# Altium project dcbuddy_split_v2.PrjPcb
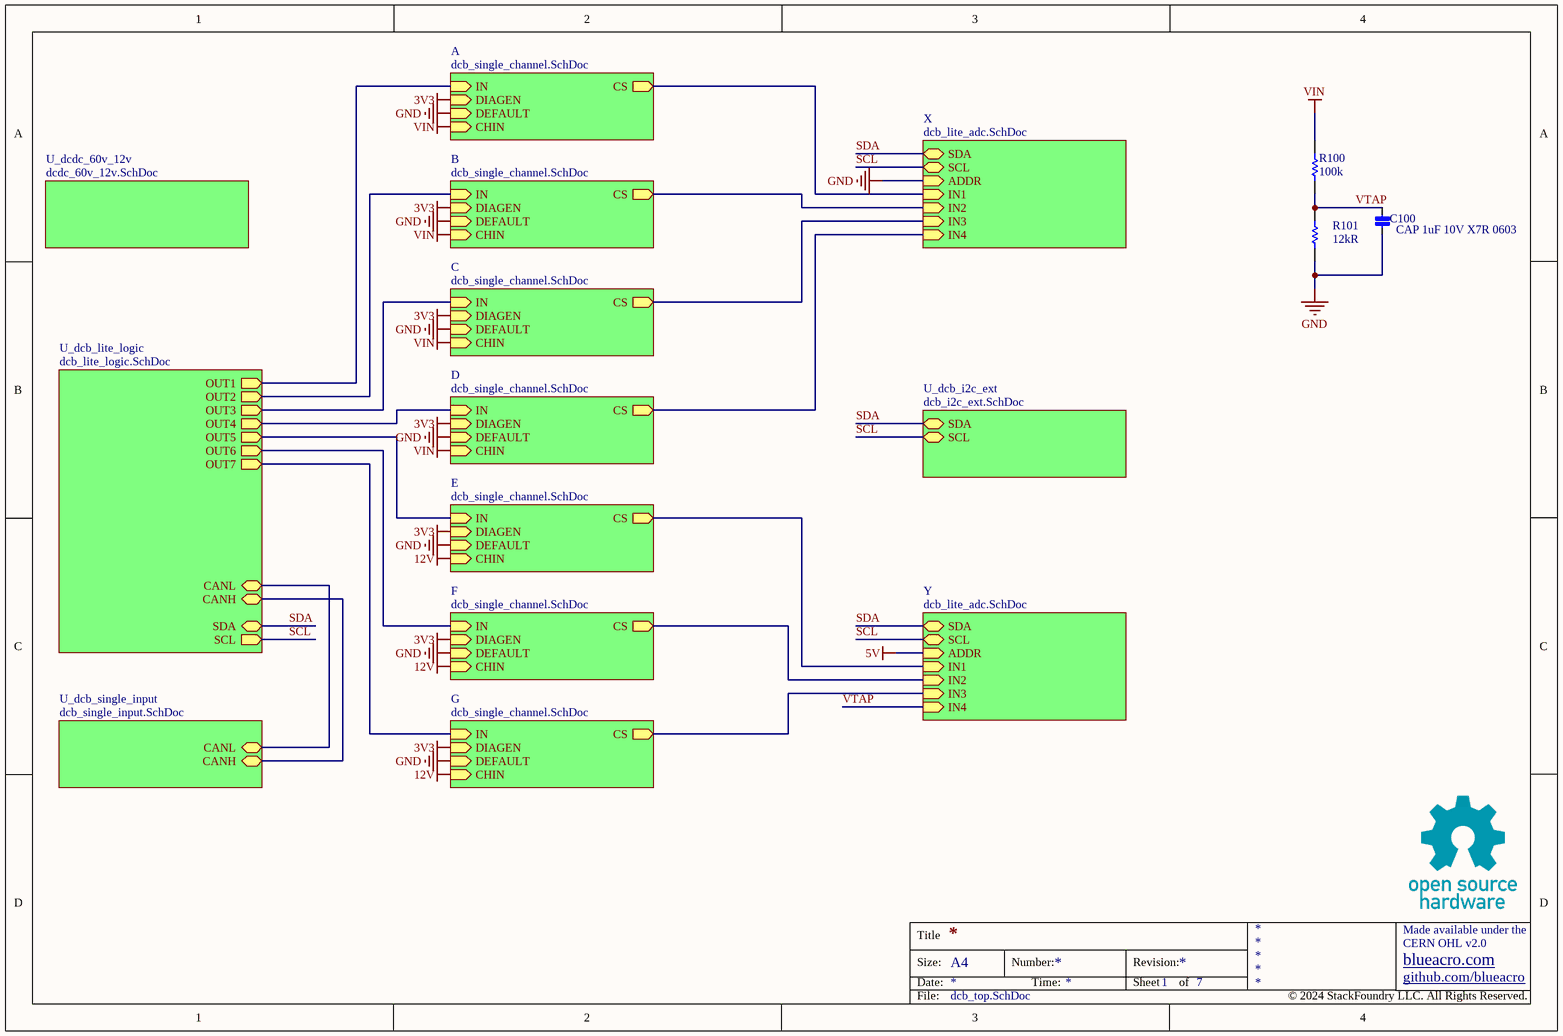
[diagram p0: dcb_top.SchDoc]
7 sheets, 174 parts. Net scope: hierarchical (ports join the sheet entries above them; power ports are global).
Board file: dcb_split_v2.PcbDoc
Sheets:
  dcb_top.SchDoc
    A = dcb_single_channel.SchDoc
    B = dcb_single_channel.SchDoc
    C = dcb_single_channel.SchDoc
    D = dcb_single_channel.SchDoc
    E = dcb_single_channel.SchDoc
    F = dcb_single_channel.SchDoc
    G = dcb_single_channel.SchDoc
    U_dcb_lite_logic = dcb_lite_logic.SchDoc
      U_usb_input = usb_input.SchDoc
    X = dcb_lite_adc.SchDoc
    Y = dcb_lite_adc.SchDoc
    U_dcb_single_input = dcb_single_input.SchDoc
    U_dcdc_60v_12v = dcdc_60v_12v.SchDoc

## Sheet dcb_top.SchDoc
size A4; SheetNumber: 1; SheetTotal: 7

### Parts
C100  CAP 1uF 10V X7R 0603  [FP-CL10-IPC_B]
R100  value 100k  [RESC1608-IPC-LL]  (hidden comment: 100k 0603 1%)
R101  value 12kR  [RESC1608X55X25LL10T15]  (hidden comment: 12k 0603 1%)

### Sub-sheets
A = dcb_single_channel.SchDoc: IN (in), DIAGEN (in), CS (out), DEFAULT (in), CHIN (in)
B = dcb_single_channel.SchDoc: IN (in), DIAGEN (in), CS (out), DEFAULT (in), CHIN (in)
C = dcb_single_channel.SchDoc: IN (in), DIAGEN (in), CS (out), DEFAULT (in), CHIN (in)
D = dcb_single_channel.SchDoc: IN (in), DIAGEN (in), CS (out), DEFAULT (in), CHIN (in)
E = dcb_single_channel.SchDoc: IN (in), DIAGEN (in), CS (out), DEFAULT (in), CHIN (in)
F = dcb_single_channel.SchDoc: IN (in), DIAGEN (in), CS (out), DEFAULT (in), CHIN (in)
G = dcb_single_channel.SchDoc: IN (in), DIAGEN (in), CS (out), DEFAULT (in), CHIN (in)
U_dcb_i2c_ext = dcb_i2c_ext.SchDoc (file not in this document): SDA (bidir), SCL (bidir)
U_dcb_lite_logic = dcb_lite_logic.SchDoc: OUT1 (out), OUT2 (out), OUT3 (out), OUT4 (out), OUT5 (out), OUT6 (out), OUT7 (out), SDA (bidir), SCL (out), CANL (bidir), CANH (bidir)
U_dcb_single_input = dcb_single_input.SchDoc: CANH (bidir), CANL (bidir)
U_dcdc_60v_12v = dcdc_60v_12v.SchDoc: no entries
X = dcb_lite_adc.SchDoc: SDA (bidir), SCL (bidir), ADDR (in), IN1 (in), IN2 (in), IN3 (in), IN4 (in)
Y = dcb_lite_adc.SchDoc: SDA (bidir), SCL (bidir), ADDR (in), IN1 (in), IN2 (in), IN3 (in), IN4 (in)

### Nets
3V3: sheet A/DIAGEN, sheet B/DIAGEN, sheet C/DIAGEN, sheet D/DIAGEN, sheet E/DIAGEN, sheet F/DIAGEN, sheet G/DIAGEN
12V: sheet E/CHIN, sheet F/CHIN, sheet G/CHIN
GND: C100.2 R101.1 ; sheet A/DEFAULT, sheet B/DEFAULT, sheet C/DEFAULT, sheet D/DEFAULT, sheet E/DEFAULT, sheet F/DEFAULT, sheet G/DEFAULT, sheet X/ADDR
VIN: R100.2 ; sheet A/CHIN, sheet B/CHIN, sheet C/CHIN, sheet D/CHIN
CANH: sheet U_dcb_lite_logic/CANH, sheet U_dcb_single_input/CANH
CANL: sheet U_dcb_lite_logic/CANL, sheet U_dcb_single_input/CANL
SCL: sheet U_dcb_lite_logic/SCL, sheet X/SCL, sheet Y/SCL, sheet U_dcb_i2c_ext/SCL
SDA: sheet U_dcb_lite_logic/SDA, sheet X/SDA, sheet Y/SDA, sheet U_dcb_i2c_ext/SDA
VTAP: C100.1 R100.1 R101.2 ; sheet Y/IN4
NetC202_A_1: sheet A/CS, sheet X/IN1
NetC202_B_1: sheet B/CS, sheet X/IN2
NetC202_C_1: sheet C/CS, sheet X/IN3
NetC202_D_1: sheet D/CS, sheet X/IN4
NetC202_E_1: sheet E/CS, sheet Y/IN1
NetC202_F_1: sheet F/CS, sheet Y/IN2
NetC202_G_1: sheet G/CS, sheet Y/IN3
NetQ200_A_1: sheet A/IN, sheet U_dcb_lite_logic/OUT1
NetQ200_B_1: sheet B/IN, sheet U_dcb_lite_logic/OUT2
NetQ200_C_1: sheet C/IN, sheet U_dcb_lite_logic/OUT3
NetQ200_D_1: sheet D/IN, sheet U_dcb_lite_logic/OUT4
NetQ200_E_1: sheet E/IN, sheet U_dcb_lite_logic/OUT5
NetQ200_F_1: sheet F/IN, sheet U_dcb_lite_logic/OUT6
NetQ200_G_1: sheet G/IN, sheet U_dcb_lite_logic/OUT7

### Notes on the sheet
- Title
- Size:
- Date:
- A4
- Number:
- Time:
- Revision:
- Sheet
- of
- github.com/blueacro
- blueacro.com
- CERN OHL v2.0
- Made available under the
- File:
- © 2024 StackFoundry LLC. All Rights Reserved.

### Library data of the parts
C100 = CMP-001-00085-7: Cap Ceramic 1uF 10V X7R 10% SMD 0603 125C Paper T/R
R100 = CMP-009-00222-1: SMD Chip Resistor, 100 kOhm, ± 1%, 100 mW, 0603 [1608 Metric], Thick Film, General Purpose; Voltage Rating: 50V; Case Code (Metric): 1608; Height: 0.45mm; Tolerance: 1%; Width: 0.8mm; Resistance Tolerance: 1%; Case/Package: 0603; Case Code (Imperial): 0603
R101 = CMP-009-00236-1: SMD Chip Resistor, 12 kOhm, ± 1%, 100 mW, 0603 [1608 Metric], Thick Film, General Purpose; Voltage Rating: 50V; Temperature Coefficient: 100ppm/°C; Power Rating: 100mW; Number of Terminations: 2; Features: Moisture Resistant; Termination: SMD/SMT; Case Code (Imperial): 0603; Pins: 2; Case Code (Metric): 1608; Depth: 0.8mm; Reach SVHC Compliant: No; Packaging: Tape and Reel; Width: 0.8mm; Resistance Tolerance: 1%; Resistor Type: Thick Film; Min Operating Temperature: -55°C; Series: RC; RoHS Compliant: Yes; Case/Package: 0603; Length: 1.6mm; Voltage Rating (DC): 50V; Lead Free: Lead Free; Max Operating Temperature: 155°C; Max Power Dissipation: 100mW; Construction: Rectangular; Tolerance: 1%; Military Standard: Not

## Sheet dcb_single_channel.SchDoc
size A4; SheetNumber: 6; SheetTotal: 8
Used 7 times, as channels A, B, C, D, E, F, G. Parts and nets are listed once, with the designators drawn on the sheet.
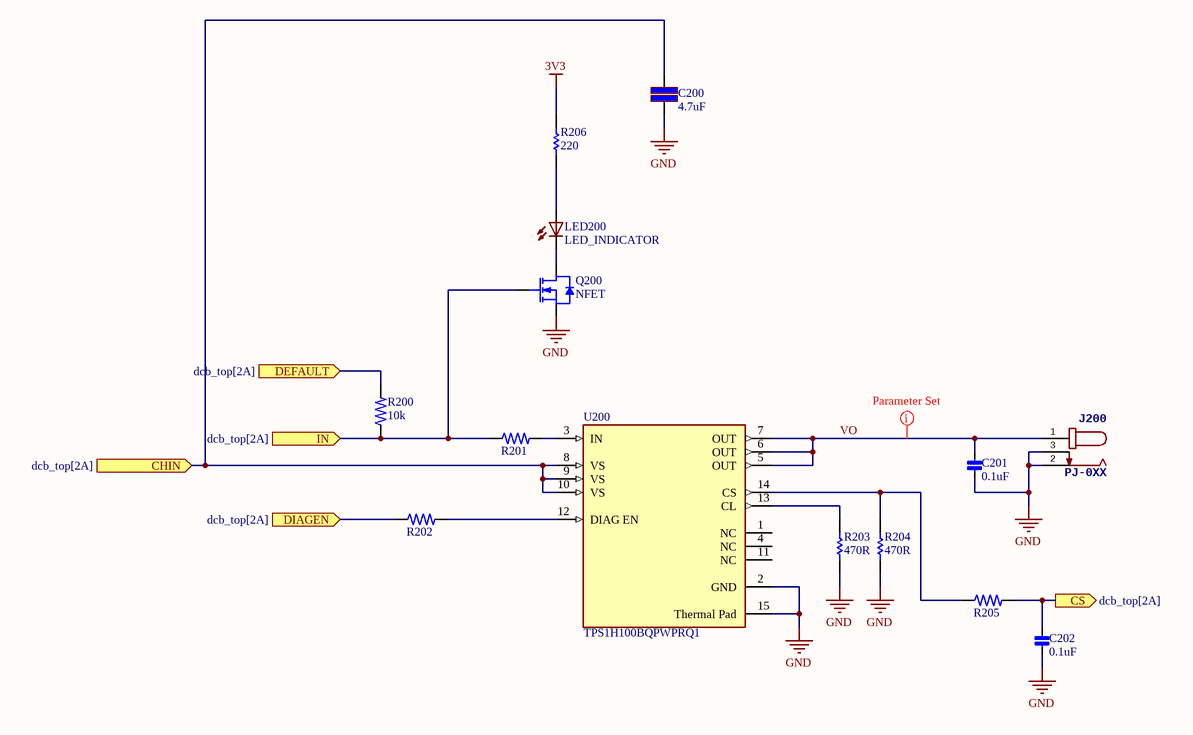
[diagram p1: dcb_single_channel.SchDoc]

### Parts
C200  value 4.7uF  [CAPC3225X20N]  (hidden comment: CAP 4.7uF 50V X7R 1210)
C201  value 0.1uF  [FP-CL10-IPC_B]  (hidden comment: CAP 0.1uF 50V X7R 0603)
C202  value 0.1uF  [FP-CL10-IPC_B]  (hidden comment: CAP 0.1uF 50V X7R 0603)
J200  PJ-0XX  [CUI-PJ-002A_V]
LED200  LED_INDICATOR  [LED5MM]
Q200  NFET  [SOT23-3]
R200  value 10k  [RESC1608-IPC-ML]  (hidden comment: 10K 0603 1%)
R201  4.7k 0603 1%  [RESC1608-IPC-ML]  (value not drawn)
R202  4.7k 0603 1%  [RESC1608-IPC-ML]  (value not drawn)
R203  value 470R  [RESC2013X60X35LL10T20]  (hidden comment: RC0805FR-07470RL)
R204  value 470R  [RESC2013X60X35LL10T20]  (hidden comment: RC0805FR-07470RL)
R205  4.7k 0603 1%  [RESC1608-IPC-ML]  (value not drawn)
R206  value 220  [RESC1608-IPC-ML]  (hidden comment: 220R 0603 5%)
U200  TPS1H100BQPWPRQ1  [FP-PWP0014C-IPC_C]

### Ports
CHIN (in, see dcb_top[2A]), CS (out, see dcb_top[2A]), DEFAULT (in, see dcb_top[2A]), DIAGEN (in, see dcb_top[2A]), IN (in, see dcb_top[2A])

### Nets
3V3: R206.2
GND: C200.1 C201.2 C202.2 J200.2 J200.3 Q200.2(S) R203.1 R204.1 U200.2(GND) U200.15(Thermal_Pad)
CHIN: C200.2 U200.8(VS) U200.9(VS) U200.10(VS) ; port CHIN
CS: C202.1 R205.2 ; port CS
DEFAULT: R200.2 ; port DEFAULT
DIAGEN: R202.1 ; port DIAGEN
IN: Q200.1(G) R200.1 R201.1 ; port IN
VO: C201.1 J200.1 U200.5(OUT) U200.6(OUT) U200.7(OUT)
NetLED200_A: LED200.A R206.1
NetLED200_C: LED200.C Q200.3(D)
NetR201_2: R201.2 U200.3(IN)
NetR202_2: R202.2 U200.12(DIAG_EN)
NetR203_2: R203.2 U200.13(CL)
NetR204_2: R204.2 R205.1 U200.14(CS)

Not connected (* = marked no-connect by the designer): U200 1(NC) 4(NC) 11(NC)

### Channels
A: designators end in _A; ports CHIN=VIN CS=NetC202_A_1 DEFAULT=GND DIAGEN=3V3 IN=NetQ200_A_1
B: designators end in _B; ports CHIN=VIN CS=NetC202_B_1 DEFAULT=GND DIAGEN=3V3 IN=NetQ200_B_1
C: designators end in _C; ports CHIN=VIN CS=NetC202_C_1 DEFAULT=GND DIAGEN=3V3 IN=NetQ200_C_1
D: designators end in _D; ports CHIN=VIN CS=NetC202_D_1 DEFAULT=GND DIAGEN=3V3 IN=NetQ200_D_1
E: designators end in _E; ports CHIN=12V CS=NetC202_E_1 DEFAULT=GND DIAGEN=3V3 IN=NetQ200_E_1
F: designators end in _F; ports CHIN=12V CS=NetC202_F_1 DEFAULT=GND DIAGEN=3V3 IN=NetQ200_F_1
G: designators end in _G; ports CHIN=12V CS=NetC202_G_1 DEFAULT=GND DIAGEN=3V3 IN=NetQ200_G_1

### Layout directives
net class HV: VO_A

### Notes on the sheet
- Title
- Size:
- Date:
- A4
- Number:
- Time:
- Revision:
- Sheet
- of
- github.com/blueacro
- blueacro.com
- CERN OHL v2.0
- Made available under the
- File:
- © 2024 StackFoundry LLC. All Rights Reserved.

### Library data of the parts
C200 = CMP-001-00083-3: CAP CER 4.7UF 50V X7R 1210; Tolerance: 10%; Material: Ceramic; Voltage: 50V; Capacitance: 4.7uF; Width: 0.098inch; Height: 1.8mm; Depth: 2.5mm; Package Quantity: 1; Case/Package: 1210; Case Code (Imperial): 1210; Contact Plating: Tin; Thickness: 0.079inch; Radiation Hardening: No; Voltage Rating: 50V; Packaging: Tape and Reel; Lead Free: Lead Free; Dielectric: X7R; Min Operating Temperature: -55°C; Case Code (Metric): 3225; Max Operating Temperature: 125°C; Mount: Surface Mount; Length: 3.2mm
C201 C202 = CMP-001-00084-7: Cap Ceramic 0.1uF 50V X7R 20% SMD 0603 125C Paper T/R; Voltage: 50V
J200 = CMP-167-0003-2: 2.0 x 6.5 mm, 2.5 A, Horizontal, Through Hole, Dc Power Jack Connector; Design Item ID: PJ-0XX; Source: con-jack.SCHLIB
LED200 = CMP-130-0003-6: Source: led.SchLib; Design Item ID: LED_INDICATOR
Q200 = CMP-094-0000-1: Design Item ID: NFET; Source: fet.SchLib
R200 = CMP-009-00191-4: Res General Purpose Thick Film 0603 10K Ohm 1% 1/10W ±100ppm/°C Molded SMD Paper T/R
R201 R202 R205 = CMP-009-00205-1: RES SMD 4.7K OHM 1% 1/10W 0603
R203 R204 = CMP-009-00233-1: SMD Chip Resistor, 470 Ohm, ± 1%, 125 mW, 0805 [2012 Metric], Thick Film, General Purpose; Voltage Rating (AC): 150V; Temperature Coefficient: 100ppm/°C; Power Rating: 125mW; Min Operating Temperature: -55°C; Series: RC; Construction: Rectangular; Resistance Tolerance: 1%; Height: 0.5mm; Resistor Type: Thick Film; Pins: 2; Case Code (Imperial): 0805; Depth: 1.25mm; Reach SVHC Compliant: Unknown; Case Code (Metric): 2012; Tolerance: 1%; Max Operating Temperature: 155°C; Termination: SMD/SMT; Length: 2mm; Lead Pitch: 0.4mm; RoHS Compliant: Yes; Case/Package: 0805; Voltage Rating: 150V; Number of Terminations: 2; Features: Moisture Resistant; Packaging: Tape and Reel; Voltage Rating (DC): 150V; Width: 1.25mm; Lead Free: Lead Free; Package Quantity: 5000; Max Power Dissipation: 125mW
R206 = CMP-009-00183-3: YAGEO - RC0603JR-07220RL - SMD Chip Resistor, 0603 [1608 Metric], 220 ohm, RC Series, 75 V, Thick Film, 100 mW; Power Rating: 100mW; Working Voltage: 75V; Temperature Coefficient: 100ppm/°C; Voltage Rating (DC): 50V; Military Standard: Not; Resistance: 220R; Case Code (Metric): 1608; Max Operating Temperature: 155°C; Tolerance: 5%; Case/Package: 0603; REACH SVHC: No SVHC; Case Code (Imperial): 0603; Number of Terminations: 2; Termination: SMD/SMT; Min Operating Temperature: -55°C; Packaging: Tape and Reel; Resistor Type: Thick Film; Number of Pins: 2; Depth: 0.8mm; Voltage Rating: 50V; Width: 0.8mm; Lead Free: Lead Free; Length: 1.6mm
U200 = CMP-024-00009-1: Current Limit SW 1-IN 1-OUT 5V to 40V 4A Automotive 14-Pin HTSSOP EP T/R; Number of Channels: 1; Min Supply Voltage: 3.5V; Output Configuration: High Side; Interface: On/Off; Fault Protection: Over Temperature; Packaging: Cut Tape; Max Supply Voltage: 40V; Lead Free: Lead Free; Max Operating Temperature: 125°C; Number of Outputs: 1; Height: 1.2mm; Length: 5mm; Pins: 14; Thickness: 1mm; RoHS Compliant: Yes; Min Operating Temperature: -40°C; Case/Package: HTSSOP; Width: 4.4mm; Series: Automotive, AEC-Q100; Max Output current: 4A

## Sheet dcb_lite_logic.SchDoc
size A4; SheetNumber: 4; SheetTotal: 8
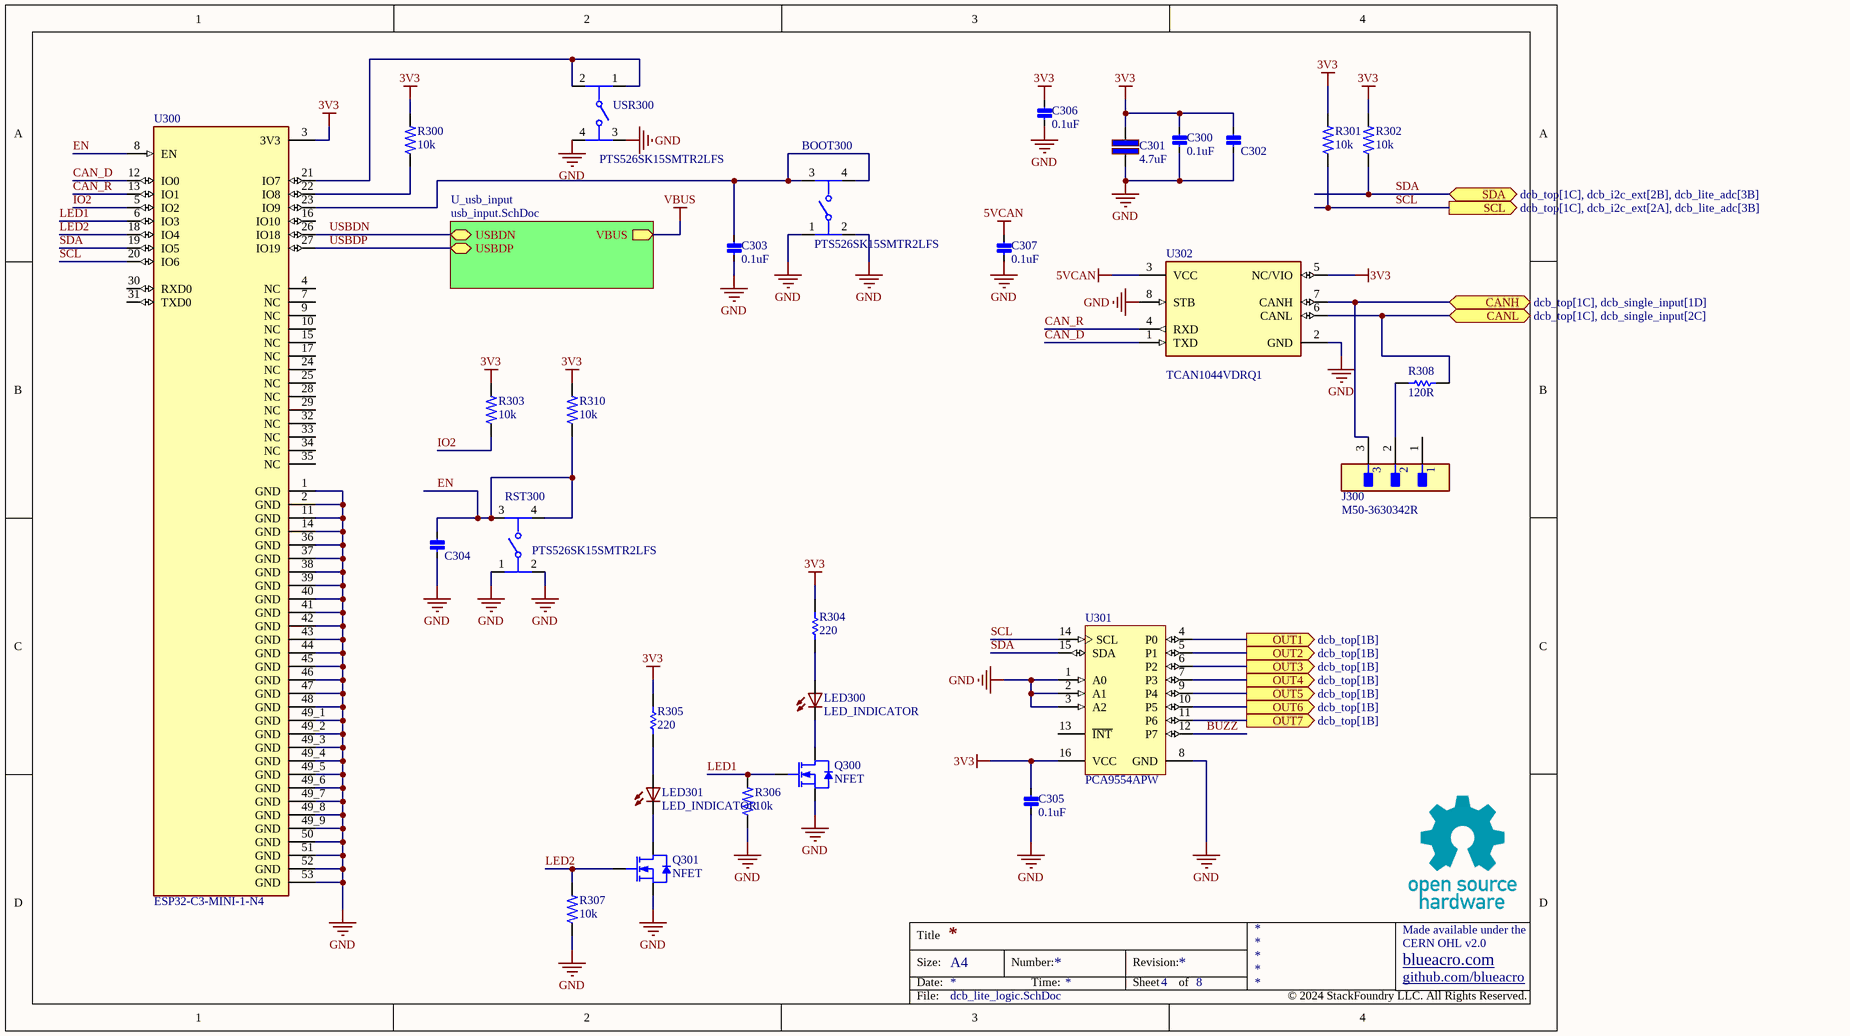
[diagram p2: dcb_lite_logic.SchDoc]

### Parts
BOOT300  PTS526SK15SMTR2LFS  [FP-PTS526SK15SMTR2LFS-MFG]
C300  value 0.1uF  [FP-CL10-IPC_B]  (hidden comment: CAP 0.1uF 50V X7R 0603)
C301  value 4.7uF  [CAPC3225X20N]  (hidden comment: CAP 4.7uF 50V X7R 1210)
C302  CAP 1uF 10V X7R 0603  [FP-CL10-IPC_B]  (value not drawn)
C303  value 0.1uF  [FP-CL10-IPC_B]  (hidden comment: CAP 0.1uF 50V X7R 0603)
C304  CAP 1uF 10V X7R 0603  [FP-CL10-IPC_B]  (value not drawn)
C305  value 0.1uF  [FP-CL10-IPC_B]  (hidden comment: CAP 0.1uF 50V X7R 0603)
C306  value 0.1uF  [FP-CL10-IPC_B]  (hidden comment: CAP 0.1uF 50V X7R 0603)
C307  value 0.1uF  [FP-CL10-IPC_B]  (hidden comment: CAP 0.1uF 50V X7R 0603)
J300  M50-3630342R  [FP-M50-3630342R-MFG]
LED300  LED_INDICATOR  [LED5MM]
LED301  LED_INDICATOR  [LED5MM]
Q300  NFET  [SOT23-3]
Q301  NFET  [SOT23-3]
R300  value 10k  [RESC1608-IPC-ML]  (hidden comment: 10K 0603 1%)
R301  value 10k  [RESC1608-IPC-ML]  (hidden comment: 10K 0603 1%)
R302  value 10k  [RESC1608-IPC-ML]  (hidden comment: 10K 0603 1%)
R303  value 10k  [RESC1608-IPC-ML]  (hidden comment: 10K 0603 1%)
R304  value 220  [RESC1608-IPC-ML]  (hidden comment: 220R 0603 5%)
R305  value 220  [RESC1608-IPC-ML]  (hidden comment: 220R 0603 5%)
R306  value 10k  [RESC1608-IPC-ML]  (hidden comment: 10K 0603 1%)
R307  value 10k  [RESC1608-IPC-ML]  (hidden comment: 10K 0603 1%)
R308  value 120R  [RESC3225X70X50LL20T20]  (hidden comment: 120R 1210 5%)
R310  value 10k  [RESC1608-IPC-ML]  (hidden comment: 10K 0603 1%)
RST300  PTS526SK15SMTR2LFS  [FP-PTS526SK15SMTR2LFS-MFG]
U300  ESP32-C3-MINI-1-N4  [XCVR_ESP32-C3-MINI-1-N4]
U301  PCA9554APW  [PW0016A_L]
U302  TCAN1044VDRQ1  [FP-D0008A-IPC_B]
USR300  PTS526SK15SMTR2LFS  [FP-PTS526SK15SMTR2LFS-MFG]

### Sub-sheets
U_usb_input = usb_input.SchDoc: USBDN (bidir), USBDP (bidir), VBUS (out)

### Ports
CANH (bidir, see dcb_top[1C], dcb_single_input[1D]), CANL (bidir, see dcb_top[1C], dcb_single_input[2C]), OUT1 (out, see dcb_top[1B]), OUT2 (out, see dcb_top[1B]), OUT3 (out, see dcb_top[1B]), OUT4 (out, see dcb_top[1B]), OUT5 (out, see dcb_top[1B]), OUT6 (out, see dcb_top[1B]), OUT7 (out, see dcb_top[1B]), SCL (out, see dcb_top[1C], dcb_i2c_ext[2A], dcb_lite_adc[3B]), SDA (bidir, see dcb_top[1C], dcb_i2c_ext[2B], dcb_lite_adc[3B])

### Nets
3V3: C300.1 C301.2 C302.1 C305.1 C306.1 R300.2 R301.2 R302.2 R303.2 R304.2 R305.2 R310.2 U300.3(3V3) U301.16(VCC) U302.5(NC/VIO)
5VCAN: C307.1 U302.3(VCC)
GND: BOOT300.1 BOOT300.2 C300.2 C301.1 C302.2 C303.2 C304.2 C305.2 C306.2 C307.2 Q300.2(S) Q301.2(S) R306.1 R307.1 RST300.1 RST300.2 U300.1(GND) U300.2(GND) U300.11(GND) U300.14(GND) U300.36(GND) U300.37(GND) U300.38(GND) U300.39(GND) U300.40(GND) U300.41(GND) U300.42(GND) U300.43(GND) U300.44(GND) U300.45(GND) U300.46(GND) U300.47(GND) U300.48(GND) U300.49_1(GND) U300.49_2(GND) U300.49_3(GND) U300.49_4(GND) U300.49_5(GND) U300.49_6(GND) U300.49_7(GND) U300.49_8(GND) U300.49_9(GND) U300.50(GND) U300.51(GND) U300.52(GND) U300.53(GND) U301.1(A0) U301.2(A1) U301.3(A2) U301.8(GND) U302.2(GND) U302.8(STB) USR300.3 USR300.4
BUZZ: U301.12(P7)
CAN_D: U300.12(IO0) U302.1(TXD)
CAN_R: U300.13(IO1) U302.4(RXD)
CANH: J300.3 U302.7(CANH) ; port CANH
CANL: R308.2 U302.6(CANL) ; port CANL
EN: C304.1 R310.1 RST300.3 RST300.4 U300.8(EN)
IO2: R303.1 U300.5(IO2)
LED1: Q300.1(G) R306.2 U300.6(IO3)
LED2: Q301.1(G) R307.2 U300.18(IO4)
SCL: R301.1 U300.20(IO6) U301.14(SCL) ; port SCL
SDA: R302.1 U300.19(IO5) U301.15(SDA) ; port SDA
USBDN: U300.26(IO18) ; sheet U_usb_input/USBDN
USBDP: U300.27(IO19) ; sheet U_usb_input/USBDP
NetBOOT300_3: BOOT300.3 BOOT300.4 C303.1 U300.23(IO9)
NetJ300_2: J300.2 R308.1
NetLED300_A: LED300.A R304.1
NetLED300_C: LED300.C Q300.3(D)
NetLED301_A: LED301.A R305.1
NetLED301_C: LED301.C Q301.3(D)
NetQ200_A_1: U301.4(P0) ; port OUT1
NetQ200_B_1: U301.5(P1) ; port OUT2
NetQ200_C_1: U301.6(P2) ; port OUT3
NetQ200_D_1: U301.7(P3) ; port OUT4
NetQ200_E_1: U301.9(P4) ; port OUT5
NetQ200_F_1: U301.10(P5) ; port OUT6
NetQ200_G_1: U301.11(P6) ; port OUT7
NetR300_1: R300.1 U300.22(IO8)
NetU300_21: U300.21(IO7) USR300.1 USR300.2

Not connected (* = marked no-connect by the designer): J300 1; U300 4(NC) 7(NC) 9(NC) 10(NC) 15(NC) 16(IO10) 17(NC) 24(NC) 25(NC) 28(NC) 29(NC) 30(RXD0) 31(TXD0) 32(NC) 33(NC) 34(NC) 35(NC); U301 13(~{INT})

### Notes on the sheet
- Title
- Size:
- Date:
- A4
- Number:
- Time:
- Revision:
- Sheet
- of
- github.com/blueacro
- blueacro.com
- CERN OHL v2.0
- Made available under the
- File:
- © 2024 StackFoundry LLC. All Rights Reserved.

### Library data of the parts
BOOT300 RST300 USR300 = CMP-011-00015-1: Switch Tactile N.O. SPST Round Button Gull Wing 0.05A 12VDC 200000Cycles 2.45N SMD T/R; Contact Current Rating: 50mA; Illumination Type: Non-Illuminated; Contact Resistance: 100mR; Number of Positions: 2; Switch Function: Off-Mom; Actuator Type: Standard; Operating Force: 260gf; Voltage Rating (DC): 12V; Ratings: IP40; Switch Travel: 0.25mm; Max Operating Temperature: 70°C; Mechanical Life: 200000Cycles; Termination: Gull Wing; Throw Configuration: SPST; Series: PTS526; Height: 1.65mm; Mounting Technology: Surface Mount; Min Operating Temperature: -20°C
C300 C303 C305-C307 = CMP-001-00084-7: as C201 on sheet dcb_single_channel; Voltage: 50V
C301 = CMP-001-00083-3: as C200 on sheet dcb_single_channel; Voltage: 50V; Capacitance: 4.7uF; Width: 0.098inch; Height: 1.8mm; Depth: 2.5mm; Package Quantity: 1; Case/Package: 1210; Case Code (Imperial): 1210; Contact Plating: Tin; Thickness: 0.079inch; Radiation Hardening: No; Voltage Rating: 50V; Packaging: Tape and Reel; Lead Free: Lead Free; Dielectric: X7R; Min Operating Temperature: -55°C; Case Code (Metric): 3225; Max Operating Temperature: 125°C; Mount: Surface Mount; Length: 3.2mm
C302 C304 = CMP-001-00085-7: as C100 on sheet dcb_top
J300 = CMP-002-00105-2: 3 Pos. Male SIL Vertical SMT Conn. RoHS Compliant: Yes; Current Rating: 1A; Number of Positions: 3; Connector Type: Header; RoHS Compliant: Yes; Series: Archer M50; Fastening Type: Pull; Min Operating Temperature: -40°C; Termination: Solder; Contact Material: Brass; Mounting Technology: Surface Mount; Packaging: Cut Tape; Contact Finish - Mating: GOLD; Contact Shape: Square; Insulation Color: Black; Contact Type: Male Pin; Max Operating Temperature: 105°C; Flammability Rating: UL94 V-0; Insulation Material: Nylon; Number of Rows: 1
LED300 LED301 = CMP-130-0003-6: Source: led.SchLib; Design Item ID: LED_INDICATOR
Q300 Q301 = CMP-094-0000-1: Design Item ID: NFET; Source: fet.SchLib
R300-R303 R306 R307 R310 = CMP-009-00191-4: as R200 on sheet dcb_single_channel
R304 R305 = CMP-009-00183-3: as R206 on sheet dcb_single_channel; Military Standard: Not; Resistance: 220R; Case Code (Metric): 1608; Max Operating Temperature: 155°C; Tolerance: 5%; Case/Package: 0603; REACH SVHC: No SVHC; Case Code (Imperial): 0603; Number of Terminations: 2; Termination: SMD/SMT; Min Operating Temperature: -55°C; Packaging: Tape and Reel; Resistor Type: Thick Film; Number of Pins: 2; Depth: 0.8mm; Voltage Rating: 50V; Width: 0.8mm; Lead Free: Lead Free; Length: 1.6mm
R308 = CMP-009-00240-1: SMD Chip Resistor, 120 Ohm, ± 5%, 500 mW, 1210 [3225 Metric], Thick Film, General Purpose; Voltage Rating: 200V; Power Rating: 500mW; Temperature Coefficient: 200ppm/°C; Case/Package: 1210; Radiation Hardening: No; Reach SVHC Compliant: No; Military Standard: Not; Length: 3.2mm; Max Power Dissipation: 500mW; Max Operating Temperature: 155°C; RoHS Compliant: Yes; Mounting Technology: Surface Mount; Series: ERJ; Height: 0.6mm; Construction: Rectangular; Termination: SMD/SMT; Case Code (Metric): 3225; Width: 2.5mm; Package Quantity: 1; Tolerance: 5%; Packaging: Tape and Reel; Technology: THICK FILM; Number of Terminations: 2; Case Code (Imperial): 1210; Depth: 2.5mm; Features: Automotive AEC-Q200; Contact Plating: Tin; Resistance Tolerance: 5%; Voltage Rating (DC): 200V; Min Operating Temperature: -55°C; Resistor Type: Thick Film
U300 = CMP-206-000000-1: Bluetooth, WiFi 802.11b/g/n, Bluetooth v5.0 Transceiver Module 2.412GHz ~ 2.484GHz PCB Trace Surface Mount; MF: Espressif Systems; Availability: In Stock; Purchase-URL: https://pricing.snapeda.com/search/part/ESP32-C3-MINI-1-N4/?ref=eda; MP: ESP32-C3-MINI-1-N4; Source: ESP32-C3-MINI-1-N4.SchLib; Check_prices: https://www.snapeda.com/parts/ESP32-C3-MINI-1-N4/Espressif+Systems/view-part/?ref=eda; Pin Count: 61; Design Item ID: ESP32-C3-MINI-1-N4; Price: None; Component Type: Standard; Package: SMD-53 Espressif Systems; SnapEDA_Link: https://www.snapeda.com/parts/ESP32-C3-MINI-1-N4/Espressif+Systems/view-part/?ref=snap; Value: *
U301 = CMP-015-00016-1: I2C/SMBus Interface 100kHz/400kHz 5.5V 16-Pin TSSOP Tube / IC I/O EXPANDER I2C 8B 16TSSOP; Number of Outputs: 8; Output Type: PUSH-PULL; Clock Frequency: 400kHz; Operating Supply Current: 104uA; Pins: 16; Operating Supply Voltage: 5.5V; Case/Package: TSSOP; Packaging: Rail/Tube; Weight: 0.002183oz; Lead Free: Lead Free; Radiation Hardening: No; Thickness: 1mm; Number of I/Os: 8; Length: 5mm; Max Operating Temperature: 85°C; Width: 4.4mm; RoHS Compliant: Yes; Height: 1.2mm; Series: -; Frequency: 400kHz; Min Operating Temperature: -40°C
U302 = CMP-015-00017-1: R-PDSO-G8 TCAN1044 Tape & Reel (TR) CAN interface transceiver 100mV 4.905mm 5Mbps -40C~125C TA; Min Supply Voltage: 4.5V; Max Supply Voltage: 5.5V; Min Operating Temperature: -40°C; Data Rate: 5Mbps; Series: Automotive, AEC-Q100; RoHS Compliant: Yes; Max Operating Temperature: 125°C; Length: 4.9mm; Pins: 8; Thickness: 1.58mm; Height: 1.75mm; Width: 3.91mm; Case/Package: SOIC; Mounting Technology: Surface Mount; Interface: CAN; Receiver Hysteresis: 100mV

## Sheet usb_input.SchDoc
size A4; SheetNumber: 5; SheetTotal: 8
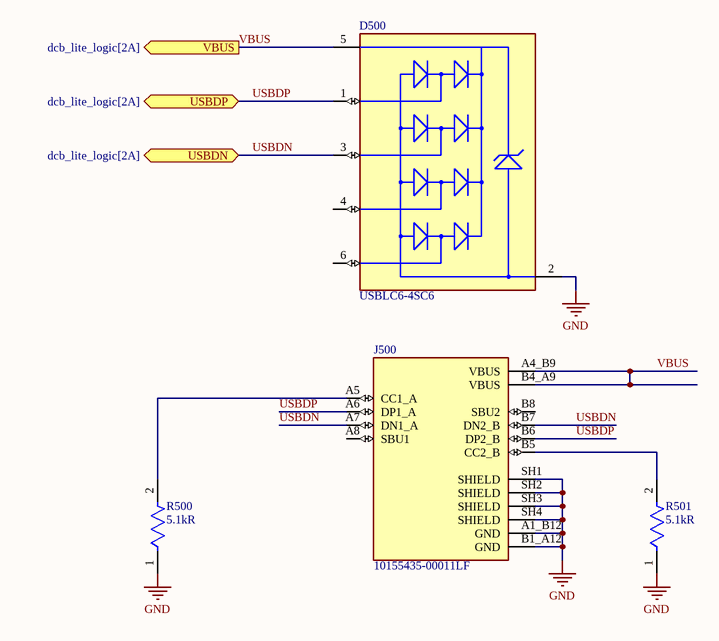
[diagram p3: usb_input.SchDoc]

### Parts
D500  USBLC6-4SC6  [FP-SOT23-6L-MFG]
J500  10155435-00011LF  [AMPHENOL_10155435-00011LF]
R500  value 5.1kR  [FP-AC0402-IPC_A]  (hidden comment: AC0402FR-075K1L)
R501  value 5.1kR  [FP-AC0402-IPC_A]  (hidden comment: AC0402FR-075K1L)

### Ports
USBDN (bidir, see dcb_lite_logic[2A]), USBDP (bidir, see dcb_lite_logic[2A]), VBUS (out, see dcb_lite_logic[2A])

### Nets
GND: D500.2(GND) J500.A1_B12(GND) J500.B1_A12(GND) J500.SH1(SHIELD) J500.SH2(SHIELD) J500.SH3(SHIELD) J500.SH4(SHIELD) R500.1 R501.1
VBUS: D500.5(VBUS) J500.A4_B9(VBUS) J500.B4_A9(VBUS) ; port VBUS
USBDN: D500.3(I/O2) J500.A7(DN1_A) J500.B7(DN2_B) ; port USBDN
USBDP: D500.1(I/O1) J500.A6(DP1_A) J500.B6(DP2_B) ; port USBDP
NetJ500_A5: J500.A5(CC1_A) R500.2
NetJ500_B5: J500.B5(CC2_B) R501.2

Not connected (* = marked no-connect by the designer): D500 4(I/O3) 6(I/O4); J500 A8(SBU1) B8(SBU2)

### Notes on the sheet
- Title
- Size:
- Date:
- A4
- Number:
- Time:
- Revision:
- Sheet
- of
- github.com/blueacro
- blueacro.com
- CERN OHL v2.0
- Made available under the
- File:
- © 2024 StackFoundry LLC. All Rights Reserved.

### Library data of the parts
D500 = CMP-004-00040-1: ESD Suppressor 15KV 6-Pin SOT-23 T/R - Product that comes on tape, but is not reeled; Clamping Voltage-Max: 17V; Direction: Unidirectional; Operating Supply Voltage: 860mV; Max Breakdown Voltage: 10V; Reverse Breakdown Voltage: 6V; Leakage Current: 150nA; Max Reverse Leakage Current: 2uA; Value: 4pF; Power Line Protection: Yes; Peak Pulse Current: 5A; Polarity: Unidirectional,Bidirectional; Number of Channels: 4; Test Current: 1mA; Number of Elements: 1; Voltage Rating (DC): 5V; Max Operating Temperature: 125°C; Termination: SMD/SMT; Case/Package: SOT-23; Reach SVHC Compliant: No; Width: 1.75mm; Lead Free: Lead Free; Packaging: Tape and Reel; Radiation Hardening: No; Length: 3.05mm; Pins: 6; Mounting Technology: Surface Mount; Min Operating Temperature: -40°C; Depth: 1.75mm; ESD Protection: Yes; Clamping Voltage: 17V; RoHS Compliant: Yes; Height: 1.3mm; Series: USB; Min Breakdown Voltage: 6V; Working Voltage: 5V; Breakdown Voltage: 6V; Number of Unidirectional Channels: 4; Reverse Standoff Voltage: 5V
J500 = CMP-243-000000-3: 16 Position 5 A USB Right Angle Receptacle Connector; MF: Amphenol ICC (FCI); MP: 10155435-00011LF; Availability: Unavailable; Design Item ID: 10155435-00011LF; Source: 10155435-00011LF.SchLib; Price: None; Package: None; Component Type: Standard; Value: *; Pin Count: 16
R500 R501 = CMP-009-00234-1: SMD Chip Resistor, 5.1 kOhm, ± 1%, 63 mW, 0402 [1005 Metric], Thick Film, General Purpose; Power Rating: 63mW; Temperature Coefficient: 100ppm/°C; Voltage Rating: 50V; Height: 0.015inch; Case/Package: 0402; Features: Moisture Resistant,Automotive AEC-Q200; Max Operating Temperature: 155°C; Case Code (Metric): 1005; Max Power Dissipation: 63mW; Width: 0.02inch; Packaging: Cut Tape; Min Operating Temperature: -55°C; Series: AC; Case Code (Imperial): 0402; Mounting Technology: Surface Mount; Tolerance: 1%; Lead Free: Lead Free; Length: 0.039inch; RoHS Compliant: Yes; Number of Terminations: 2

## Sheet dcb_lite_adc.SchDoc
size A4; SheetNumber: 3; SheetTotal: 8
Used 2 times, as channels X, Y. Parts and nets are listed once, with the designators drawn on the sheet.
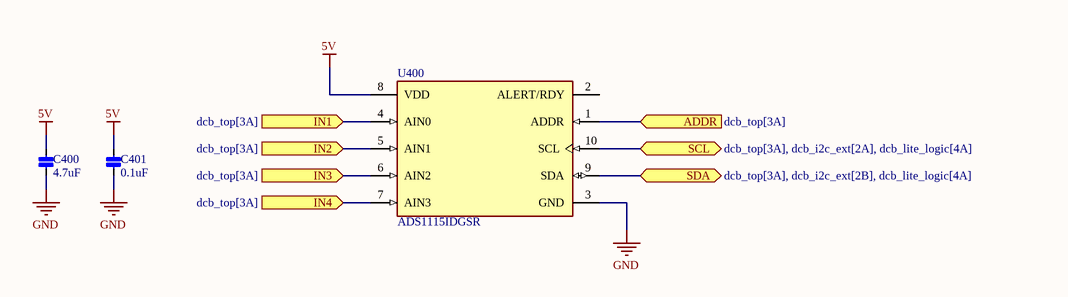
[diagram p4: dcb_lite_adc.SchDoc]

### Parts
C400  value 4.7uF  [FP-CL10-IPC_C]  (hidden comment: CAP 4.7uF 0603 6.3V X7R)
C401  value 0.1uF  [FP-CL10-IPC_B]  (hidden comment: CAP 0.1uF 50V X7R 0603)
U400  ADS1115IDGSR  [FP-DGS0010A-MFG]

### Ports
ADDR (in, see dcb_top[3A]), IN1 (in, see dcb_top[3A]), IN2 (in, see dcb_top[3A]), IN3 (in, see dcb_top[3A]), IN4 (in, see dcb_top[3A]), SCL (bidir, see dcb_top[3A], dcb_i2c_ext[2A], dcb_lite_logic[4A]), SDA (bidir, see dcb_top[3A], dcb_i2c_ext[2B], dcb_lite_logic[4A])

### Nets
5V: C400.1 C401.1 U400.8(VDD)
GND: C400.2 C401.2 U400.3(GND)
ADDR: U400.1(ADDR) ; port ADDR
IN1: U400.4(AIN0) ; port IN1
IN2: U400.5(AIN1) ; port IN2
IN3: U400.6(AIN2) ; port IN3
IN4: U400.7(AIN3) ; port IN4
SCL: U400.10(SCL) ; port SCL
SDA: U400.9(SDA) ; port SDA

Not connected (* = marked no-connect by the designer): U400 2(ALERT/RDY)

### Channels
X: designators end in _X; ports ADDR=GND IN1=NetC202_A_1 IN2=NetC202_B_1 IN3=NetC202_C_1 IN4=NetC202_D_1 SCL=SCL SDA=SDA
Y: designators end in _Y; ports ADDR=5V IN1=NetC202_E_1 IN2=NetC202_F_1 IN3=NetC202_G_1 IN4=VTAP SCL=SCL SDA=SDA

### Notes on the sheet
- Title
- Size:
- Date:
- A4
- Number:
- Time:
- Revision:
- Sheet
- of
- github.com/blueacro
- blueacro.com
- CERN OHL v2.0
- Made available under the
- File:
- © 2024 StackFoundry LLC. All Rights Reserved.

### Library data of the parts
C400 = CMP-001-00101-4: Cap Ceramic 4.7uF 6.3V X7R 10% SMD 0603 125°C Paper T/R
C401 = CMP-001-00084-7: as C201 on sheet dcb_single_channel; Voltage: 50V
U400 = CMP-015-00014-1: 4-Channel Single ADC Delta-Sigma 860sps 16-bit Serial 10-Pin VSSOP T/R; Sampling Rate: 860S/s; Min Supply Voltage: 2V; Number of Inputs: 4; Number of Channels: 2; Power Dissipation: 900uW; Number of Bits: 16; Max Supply Voltage: 5.5V; Number of Converters: 1; Conversion Rate: 0.86KS/s; Integral Nonlinearity (INL): 1LSB; Polarity: Bipolar; Nominal Supply Current: 150uA; Resolution: 16b; Interface: I2C; Max Operating Temperature: 125°C; Thickness: 1.02mm; Supply Type: Single; RoHS Compliant: Yes; Length: 3mm; Min Operating Temperature: -40°C; Package Quantity: 2500; Series: -; Lead Free: Lead Free; Contact Plating: Gold; Min Supply Voltage (DC): 2V; Height: 1.07mm; Case/Package: VSSOP; Width: 3mm; Packaging: Tape and Reel; Number of A/D Converters: 1; Pins: 10; Max Supply Voltage (DC): 5.5V; Reach SVHC Compliant: No

## Sheet dcb_single_input.SchDoc
size A4; SheetNumber: 7; SheetTotal: 8
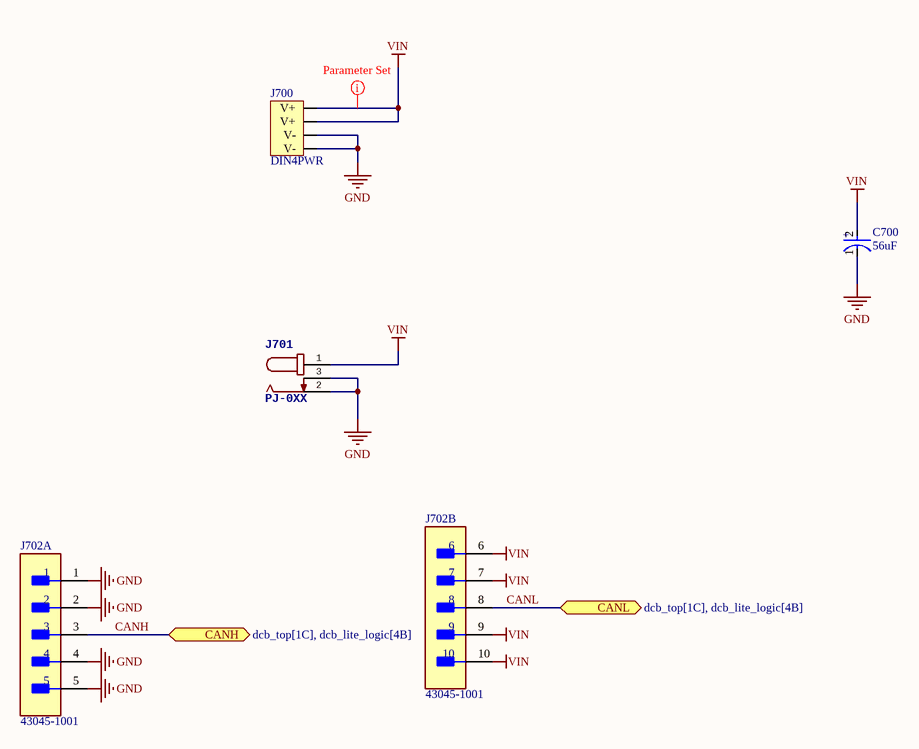
[diagram p5: dcb_single_input.SchDoc]

### Parts
C700  value 56uF  [FP-FKG-MFG]  (hidden comment: CAP 56uF 63V Poly 10mm)
J700  DIN4PWR  [PD40S]
J701  PJ-0XX  [CUI-PJ-002A_V]
J702  43045-1001  [FP-43045-1001-MFG]  (parts A,B of 2)

### Ports
CANH (bidir, see dcb_top[1C], dcb_lite_logic[4B]), CANL (bidir, see dcb_top[1C], dcb_lite_logic[4B])

### Nets
GND: C700.1(C) J700.1(V-) J700.3(V-) J701.2 J701.3 J702.1 J702.2 J702.4 J702.5
VIN: C700.2(A) J700.2(V+) J700.4(V+) J701.1 J702.6 J702.7 J702.9 J702.10
CANH: J702.3 ; port CANH
CANL: J702.8 ; port CANL

### Layout directives
net class HV: VIN

### Notes on the sheet
- Title
- Size:
- Date:
- A4
- Number:
- Time:
- Revision:
- Sheet
- of
- github.com/blueacro
- blueacro.com
- CERN OHL v2.0
- Made available under the
- File:
- © 2024 StackFoundry LLC. All Rights Reserved.
- (in symbol CMP-001-00124-1) +

### Library data of the parts
C700 = CMP-001-00124-1: Cap Aluminum 56uF 63V 20% (10 X 10.2mm) SMD 0.03 Ohm 1800mA 5000h 105 C Embossed T/R; Lead Diameter: 0.9mm; Ripple Current: 1.8A; ESR (Equivalent Series Resistance): 30mR; Material: Polymer; Leakage Current: 3uA; Life (Hours): 5000Hour; Tolerance: 20%; Diameter: 10mm; Min Operating Temperature: -55°C; Package Quantity: 500; Max Operating Temperature: 105°C; Voltage Rating (DC): 63V; Lead Pitch: 4.6mm; Ratings: AEC-Q200; Termination: SMD/SMT; Length: 10.2mm; Voltage Rating: 63V; RoHS Compliant: Yes; Ripple Current (AC): 1.8A; Series: ZA; Mounting Technology: Surface Mount,PCB; Height: 10.2mm; Radiation Hardening: No; Case/Package: Radial; Technology: HYBRID; Reach SVHC Compliant: No; Voltage: 63V; Packaging: Tape and Reel; Construction: Cylindrical; Lead Free: Lead Free
J700 = CMP-167-0005-1: Design Item ID: DIN4PWR; Source: con-jack.SCHLIB
J701 = CMP-167-0003-2: as J200 on sheet dcb_single_channel; Design Item ID: PJ-0XX; Source: con-jack.SCHLIB
J702 = CMP-002-00106-1: Connector Wire to Board Header 10 Position 3 mm Solder Right Angle Thru-Hole Micro-Fit 3.0™; Manufacturer Series: 43045; Gender: Male; DIN Conformance: No; Connector Type: Plug; Pitch: 3mm; Insulation Resistance: 1GR; Number of Contacts: 10; Glow Wire Compliant: Compliant; Voltage Rating: 600V; Voltage Rating (DC): 250V; Current Rating: 5A; Option: General Purpose; Plating: Tin; Orientation: Right Angle; Reach SVHC Compliant: No; RoHS Compliant: Yes; Flammability Rating: UL94 V-0; Contact Plating: Gold; Halogen Free: Low Halogen; Series: Micro-Fit 3.0; Packaging: Tray; Package Quantity: 1224; IEC Conformance: No; Number of Circuits: 10; MIL Conformance: No; Number of Rows: 2; Termination: Through Hole; Housing Material: Thermoplastic; Radiation Hardening: No; Row Spacing: 3mm; Contact Material: Brass; Case/Package: SMC; Number of Positions: 10; Color: Black

## Sheet dcdc_60v_12v.SchDoc
size A4; SheetNumber: 8; SheetTotal: 8; SPICEModelCacheOFSRASBJ: <root> / <DocumentId>OFSRASBJ</DocumentId> / <CacheFrame Number="0"> / <Model Name="tmk325b7226_m-pr" Kind="CKT"> / <Text>* TMK325B7226_M-PR     SPICE MODEL  ( General Type ) / *-------------------------------------------------------------------------------------------------------- / * Model Generated by TAIYO YUDEN Corporation (http://www.ty-top.com) / * Version 1.0 / * TAIYO YUDEN Control No. 170508_150330 / * Copyright(c) 2015 TAIYO YUDEN CO.,LTD. All Rights Reserved. / *-------------------------------------------------------------------------------------------------------- / * / * Products Name : Multilayer Ceramic Capacitors / * / * Characteristics : / *     Capacitance : 22 uF , Rated Voltage : 25V , TCC : X7R / *     Case Size : 3.2 x 2.5 / 0.126 x 0.098 [mm/inch] , Thickness : 2.5 / 0.098 [mm/inch] / *     (Conditions: Temperature = 25 degC , DC Bias Current/Voltage = 0A / 0V) / * / * Frequency Range : 40Hz - 3GHz / * / * External Node Assignments : / * / *  1  o---| |---o  2 / * / *-------------------------------------------------------------------------------------------------------- / .SubCkt TMK325B7226_M-PR 1 2 / **************************** / C0 1 110 20.232u / Cm 1 101 1.4192u / C1 101 102 0.46072u / Rc1 101 102 383.24 / C2 102 103 0.25707u / Rc2 102 103 27.255 / C3 103 110 0.063707u / Rc3 103 110 9.0927 / C2m 1 301 2.8514u / C21 301 302 4.5381u / Rc21 301 302 971.82 / C22 302 303 5.7922u / Rc22 302 303 294.55 / C23 303 304 5.617u / Rc23 303 304 301.8 / C24 304 305 2.3653u / Rc24 304 305 34.154 / C25 305 306 1.0031u / Rc25 305 306 28.966 / C26 306 307 0.1463u / Rc26 306 307 1.8028 / C27 307 308 0.26562u / Rc27 307 308 0.93359 / C28 308 309 0.29812u / Rc28 308 309 0.7461 / C29 309 110 3869.2p / Rc29 309 110 3.935 / Rp0 1 110 4.54545454545455Meg / L0 110 120 0.19079n / Lm 120 130 0.18902n / L1 120 121 0.21321n / RL1 121 130 0.13225 / L2 120 122 0.31017n / RL2 122 130 0.16258 / L3 120 123 1.2596n / RL3 123 130 144.01 / CR 120 124 3.8286u / LR 124 125 0.37731n / RR 125 130 10.878m / CL 130 140 3.0471p / LL 130 140 0.15642n / RL 130 140 11.971 / Rs 140 2 2.3557m / **************************** / .ends TMK325B7226_M-PR</Text> / </Model> / </CacheFrame> / </root>
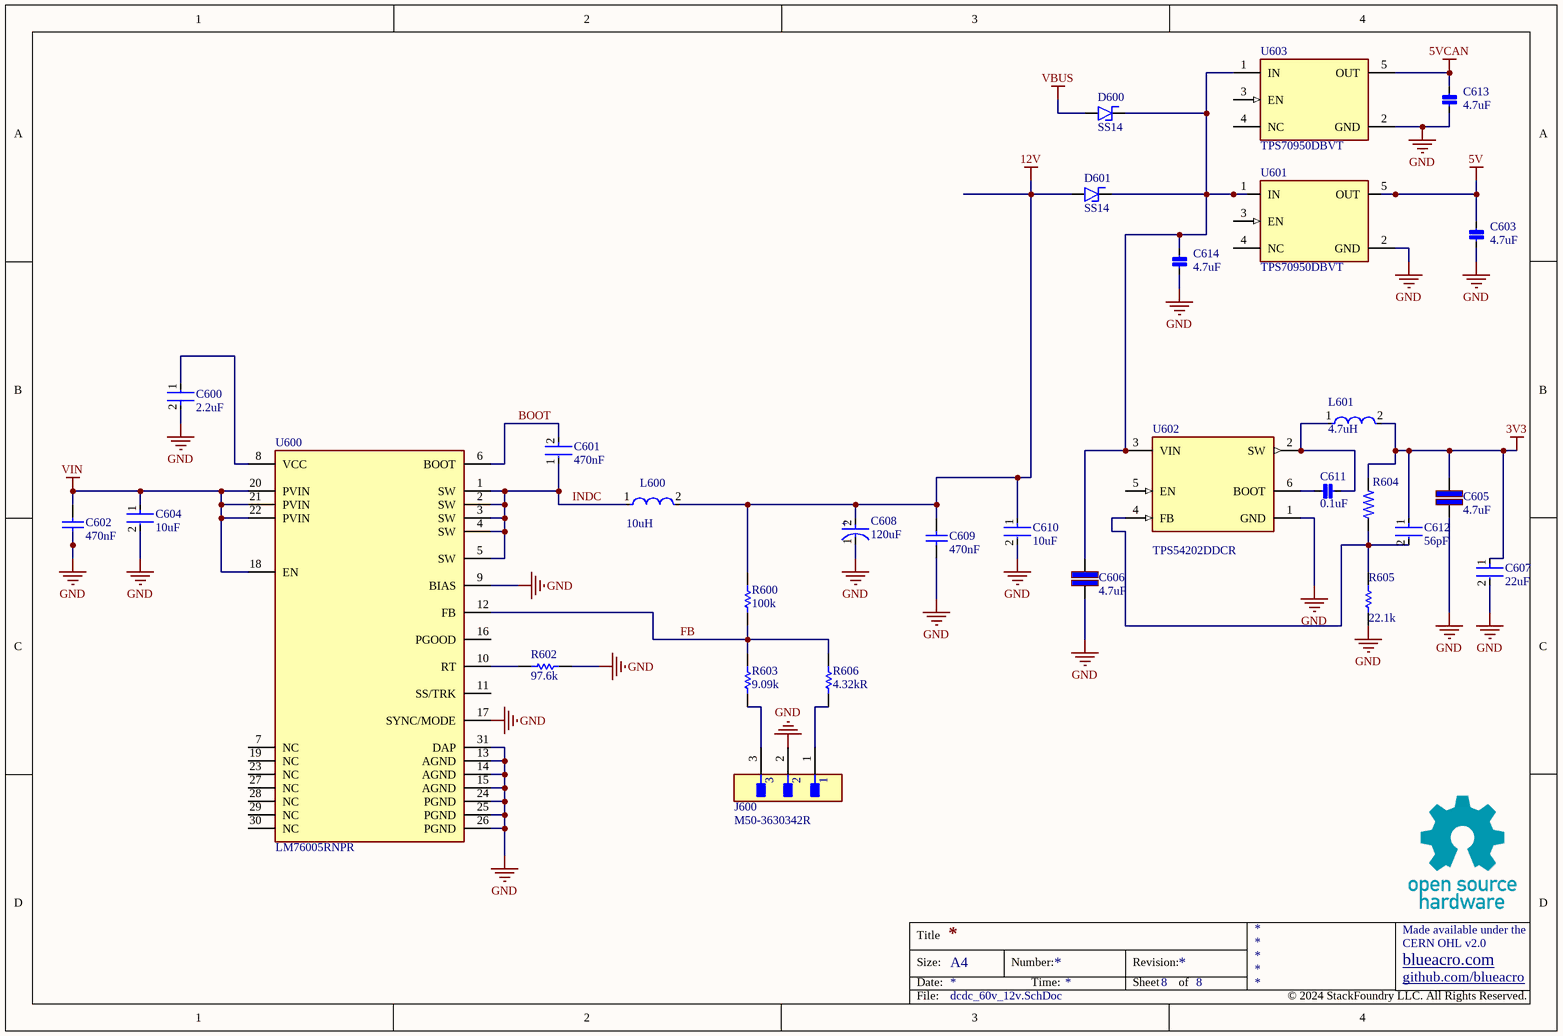
[diagram p6: dcdc_60v_12v.SchDoc]

### Parts
C600  value 2.2uF  [FP-C1608-080-0_1-IPC_A]  (hidden comment: CAP 2.2uF 0603 16V X6S)
C601  value 470nF  [FP-C1608-080-0_1-IPC_A]  (hidden comment: CAP 0.47uF 50V 0603)
C602  value 470nF  [CAPC1210(3225)230_M]  (hidden comment: CAP 0.47uF 1210 50V X7R)
C603  value 4.7uF  [FP-CL10-IPC_C]  (hidden comment: CAP 4.7uF 0603 6.3V X7R)
C604  value 10uF  [FP-GRM32E-0_2-0_3-MFG]  (hidden comment: CAP 10uF 1210 63V X7R)
C605  value 4.7uF  [CAPC3225X20N]  (hidden comment: CAP 4.7uF 50V X7R 1210)
C606  value 4.7uF  [CAPC3225X20N]  (hidden comment: CAP 4.7uF 50V X7R 1210)
C607  value 22uF  [FP-1210-L_3_2_0_3-W_2_5_0-MFG]  (hidden comment: CAP 22uF 25V 1210 X7R)
C608  value 120uF  [FP-OS-CON-SMT-F12-MFG]  (hidden comment: CAP 120uF 35V Poly 10mm)
C609  value 470nF  [CAPC1210(3225)230_M]  (hidden comment: CAP 0.47uF 1210 50V X7R)
C610  value 10uF  [FP-GRM32E-0_2-0_3-MFG]  (hidden comment: CAP 10uF 1210 63V X7R)
C611  value 0.1uF  [FP-CL10-IPC_B]  (hidden comment: CAP 0.1uF 50V X7R 0603)
C612  value 56pF  [FP-C0603C-CF-IPC_B]  (hidden comment: C0603C560J5GACTU)
C613  value 4.7uF  [FP-CL10-IPC_C]  (hidden comment: CAP 4.7uF 0603 6.3V X7R)
C614  value 4.7uF  [FP-CL10-IPC_C]  (hidden comment: CAP 4.7uF 0603 6.3V X7R)
D600  SS14  [SMA]
D601  SS14  [SMA]
J600  M50-3630342R  [FP-M50-3630342R-MFG]
L600  value 10uH  [FP-IHLP-5050FD-FP_2_945x4-MFG]  (hidden comment: IHLP5050FDER100M01)
L601  value 4.7uH  [FP-SRN4018-MFG]  (hidden comment: SRN4018-4R7M)
R600  value 100k  [RESC1608-IPC-LL]  (hidden comment: 100k 0603 1%)
R602  value 97.6k  [RESC1608-IPC-LL]  (hidden comment: 97.6k 0603 1%)
R603  value 9.09k  [RESC1608-IPC-LL]  (hidden comment: 9.09k 0603 1%)
R604  100k 0603 1%  [RESC1608-IPC-LL]  (value not drawn)
R605  value 22.1k  [RESC1608-IPC-LL]  (hidden comment: 22.1k 0603 0.1%)
R606  value 4.32kR  [RESC1608X55X30LL15T15]  (hidden comment: 4.32k 0603 1%)
U600  LM76005RNPR  [FP-RNP0030A-MFG]
U601  TPS70950DBVT  [FP-DBV0005A-IPC_B]
U602  TPS54202DDCR  [FP-DDC0006A-IPC_C]
U603  TPS70950DBVT  [FP-DBV0005A-IPC_B]

### Nets
3V3: C605.2 C607.1 C612.1 L601.2 R604.2
5V: C603.1 U601.5(OUT)
5VCAN: C613.1 U603.5(OUT)
12V: C608.2(A) C609.2 C610.1 D601.A L600.2 R600.2
GND: C600.2 C602.1 C603.2 C604.2 C605.1 C606.1 C607.2 C608.1(C) C609.1 C610.2 C613.2 C614.2 J600.2 R602.2 R605.1 U600.9(BIAS) U600.13(AGND) U600.14(AGND) U600.15(AGND) U600.17(SYNC/MODE) U600.24(PGND) U600.25(PGND) U600.26(PGND) U600.31(DAP) U601.2(GND) U602.1(GND) U603.2(GND)
VBUS: D600.A
VIN: C602.2 C604.1 U600.18(EN) U600.20(PVIN) U600.21(PVIN) U600.22(PVIN)
BOOT: C601.2 U600.6(BOOT)
FB: R600.1 R603.2 R606.2 U600.12(FB)
INDC: C601.1 L600.1 U600.1(SW) U600.2(SW) U600.3(SW) U600.4(SW) U600.5(SW)
NetC600_1: C600.1 U600.8(VCC)
NetC606_2: C606.2 C614.1 D600.K D601.K U601.1(IN) U602.3(VIN) U603.1(IN)
NetC611_1: C611.1 U602.6(BOOT)
NetC611_2: C611.2 L601.1 U602.2(SW)
NetC612_2: C612.2 R604.1 R605.2 U602.4(FB)
NetJ600_1: J600.1 R606.1
NetJ600_3: J600.3 R603.1
NetR602_1: R602.1 U600.10(RT)

Not connected (* = marked no-connect by the designer): U600 7(NC) 11(SS/TRK) 16(PGOOD) 19(NC) 23(NC) 27(NC) 28(NC) 29(NC) 30(NC); U601 3(EN) 4(NC); U602 5(EN); U603 3(EN) 4(NC)

### Notes on the sheet
- Title
- Size:
- Date:
- A4
- Number:
- Time:
- Revision:
- Sheet
- of
- github.com/blueacro
- blueacro.com
- CERN OHL v2.0
- Made available under the
- File:
- © 2024 StackFoundry LLC. All Rights Reserved.
- (in symbol CMP-001-00127-1) +

### Library data of the parts
C600 = CMP-001-00117-2: Cap Ceramic 2.2uF 16V X6S 10% Pad SMD 0603 105°C Low ESR T/R; Length: 1.6mm; Height: 0.8mm; Case/Package: 0603; Tolerance: 10%; Series: C; Dielectric Material: Ceramic; Dielectric: X6S; Construction: Flat; Case Code (Metric): 1608; Lead Free: Lead Free; Case Code (Imperial): 0603; Depth: 0.8mm; Thickness: 0.035inch; Voltage Rating: 16V
C601 = CMP-001-00116-2: Multilayer Ceramic Capacitor, 0.47 uF, 50 V, ± 10%, X7R, 0603 [1608 Metric]; Height: 0.8mm; Tolerance: 10%; Length: 1.6mm; Voltage Rating: 50V; Depth: 0.8mm; Case Code (Metric): 1608; Voltage: 50V; Lead Free: Lead Free; Series: C; Dielectric: X7R; Dielectric Material: Ceramic; Construction: Flat; Case Code (Imperial): 0603; Case/Package: 0603; Material: Ceramic
C602 C609 = CMP-001-00128-1: Multilayer Ceramic Capacitor, 0.47 uF, 50 V, ± 10%, X7R, 1210 [3225 Metric]; Termination: SMD/SMT; Voltage Rating: 50V; Dielectric: X7R; Case Code (Metric): 3225; Case/Package: 1210; Thickness: 0.041inch; Tolerance: 10%; Lead Free: Lead Free; Depth: 2.5mm; Case Code (Imperial): 1210; Length: 3.2mm; Voltage Rating (DC): 50V; Series: C; Height: 0.95mm; Construction: Flat; RoHS Compliant: Yes; Package Quantity: 1; Dielectric Material: Ceramic; Width: 0.098inch; Reach SVHC Compliant: No; Min Operating Temperature: -55°C; Packaging: Tape and Reel; Voltage: 50V; Mounting Technology: Surface Mount,PCB; Max Operating Temperature: 125°C
C603 C613 C614 = CMP-001-00101-4: as C400 on sheet dcb_lite_adc
C604 C610 = CMP-001-00119-1: Multilayer Ceramic Capacitors MLCC - SMD/SMT 1210 10uF 63volts *Derate Voltage/Temp; Tolerance: 10%; Voltage Rating: 63V; Case Code (Metric): 3225; Voltage: 63V; Thickness: 0.106inch; Case Code (Imperial): 1210; Dielectric Material: Ceramic; Depth: 2.5mm; Material: Ceramic; Series: GRM; Length: 3.2mm; Height: 2.5mm; Width: 2.5mm; Voltage Rating (DC): 63V; Termination: SMD/SMT; Dielectric: X7R; Case/Package: 1210
C605 C606 = CMP-001-00083-3: as C200 on sheet dcb_single_channel; Voltage: 50V; Capacitance: 4.7uF; Width: 0.098inch; Height: 1.8mm; Depth: 2.5mm; Package Quantity: 1; Case/Package: 1210; Case Code (Imperial): 1210; Contact Plating: Tin; Thickness: 0.079inch; Radiation Hardening: No; Voltage Rating: 50V; Packaging: Tape and Reel; Lead Free: Lead Free; Dielectric: X7R; Min Operating Temperature: -55°C; Case Code (Metric): 3225; Max Operating Temperature: 125°C; Mount: Surface Mount; Length: 3.2mm
C607 = CMP-001-00125-1: 1210 22 uF 25 V ±20% Tolerance X7R Multilayer Ceramic Chip Capacitor; Tolerance: 20%; Series: M; Max Operating Temperature: 125°C; Min Operating Temperature: -55°C; Case Code (Metric): 3225; Mounting Technology: Surface Mount; Case/Package: 1210; RoHS Compliant: Yes; Voltage Rating: 25V; Packaging: Tape and Reel; Case Code (Imperial): 1210
C608 = CMP-001-00127-1: Cap Aluminum Polymer 120uF 35VDC 20%( 10 X 12.6mm) SMD 0.018 Ohm 4400mA 5000h 105C T/R; Leakage Current: 840uA; Ripple Current (AC): 4.4A; Dissipation Factor: 12%; ESR (Equivalent Series Resistance): 18mR; Life (Hours): 5000Hour; Max Operating Temperature: 105°C; Height: 12.6mm; Min Operating Temperature: -55°C; Diameter: 10mm; Length: 12.6mm; Voltage: 35V; Tolerance: 20%; Voltage Rating: 35V; Lead Free: Lead Free; Voltage Rating (DC): 35V; Case/Package: Radial; Ripple Current: 4.4A; Series: OS-CON™, SVPF; Package Quantity: 400; Termination: SMD/SMT; Pins: 12; Material: Polymer; Packaging: Tape and Reel; RoHS Compliant: Yes; Mounting Technology: Surface Mount,PCB; Reach SVHC Compliant: No
C611 = CMP-001-00084-7: as C201 on sheet dcb_single_channel; Voltage: 50V
C612 = CMP-001-00126-1: Multilayer Ceramic Capacitor, 56 pF, 50 V, ± 5%, C0G (NP0), 0603 [1608 Metric]; Temperature Coefficient: 30ppm/°C; Voltage Rating (DC): 50V; Radiation Hardening: No; Min Operating Temperature: -55°C; Pins: 2; Depth: 0.8mm; Termination: SMD/SMT; Dielectric: C0G; Thickness: 0.034inch; Package Quantity: 1; RoHS Compliant: Yes; Reach SVHC Compliant: No; Lead Free: Lead Free; Length: 1.6mm; Mounting Technology: Surface Mount,PCB; Packaging: Tape and Reel; Width: 0.031inch; Height: 0.8mm; Material: Ceramic; Series: C; Case Code (Metric): 1608; Tolerance: 5%; Max Operating Temperature: 125°C; Lead Pitch: 0.7mm; Voltage Rating: 50V; Case Code (Imperial): 0603; Construction: Flat; Case/Package: 0603
D600 D601 = CMP-080-0002-2: Source: diode.SCHLIB; Design Item ID: DIODE_SCHOTTKY
J600 = CMP-002-00105-2: as J300 on sheet dcb_lite_logic; RoHS Compliant: Yes; Series: Archer M50; Fastening Type: Pull; Min Operating Temperature: -40°C; Termination: Solder; Contact Material: Brass; Mounting Technology: Surface Mount; Packaging: Cut Tape; Contact Finish - Mating: GOLD; Contact Shape: Square; Insulation Color: Black; Contact Type: Male Pin; Max Operating Temperature: 105°C; Flammability Rating: UL94 V-0; Insulation Material: Nylon; Number of Rows: 1
L600 = CMP-006-00033-1: Inductor Power Shielded Wirewound 10uH 20% 100KHz Powdered Iron 10A 17.2mOhm DCR 5050 T/R; Core Material: Metal,Composite,Ferrite; Max DC Current: 15.5A; DC Resistance (DCR): 17.2mR; Self Resonant Frequency: 5MHz; Case/Package: 5050; Width: 12.9mm; Mounting Technology: Surface Mount; Height: 6.5mm; Saturation Current: 15.5A; Tolerance: 20%; Length: 13.2mm; Depth: 12.9mm; Inductance Tolerance: 20%; Test Frequency: 100kHz; RMS Current (Irms): 10A; Shielding: Shielded; Pins: 2; ESR: 17.2mR; Max Operating Temperature: 125°C; Max Current Rating: 10A; Lead Free: Lead Free; Military Standard: Not; Reach SVHC Compliant: Unknown; Packaging: Tape and Reel; RoHS Compliant: Yes; Package Quantity: 250; Series: IHLP-5050FD-01; Termination: SMD/SMT; Radiation Hardening: No; Min Operating Temperature: -55°C
L601 = CMP-006-00036-2: Ind Power Semi-Shielded Wirewound 4.7uH 20% 100KHz Ferrite 1.9A 1515 T/R; Material: Steel; Self Resonant Frequency: 35MHz; DC Resistance (DCR): 84mR; Saturation Current: 2A; Q Factor: 9; Radiation Hardening: No; Reach SVHC Compliant: No; Sample Rate (Hz): 100kHz; Package Quantity: 3000; RoHS Compliant: Yes; Depth: 4.2mm; Max DC Current: 1.9A; Case/Package: Nonstandard; Min Operating Temperature: -25°C; Test Frequency: 100kHz; Max Operating Temperature: 120°C; Pins: 2; Shielding: Shielded; Packaging: Cut Tape; Height - Seated (Max): 0.071inch; Inductance Tolerance: 20%; RMS Current (Irms): 1.9A; Current Rating: 1.9A; Core Material: Ferrite; Width: 4mm; Height: 1.8mm; Tolerance: 20%; Length: 4mm; Series: SRN4018; Termination: SMD/SMT; Mounting Technology: Surface Mount; ESR: 84mR
R600 = CMP-009-00222-1: as R100 on sheet dcb_top; Case Code (Metric): 1608; Height: 0.45mm; Tolerance: 1%; Width: 0.8mm; Resistance Tolerance: 1%; Case/Package: 0603; Case Code (Imperial): 0603
R602 = CMP-009-00223-1: Res Thick Film 0603 97.6K Ohm 1% 1/10W ±100ppm/°C Molded SMD Paper T/R; Voltage Rating: 75V; Power Rating: 100mW; Contact Plating: Tin,Matte; Series: RC; Tolerance: 1%; Case/Package: 0603; Height: 0.022inch; Width: 0.031inch; Weight: 7.1E-05oz; Case Code (Imperial): 0603; Case Code (Metric): 1608
R603 = CMP-009-00221-1: SMD Chip Resistor, 9.09 kOhm, ± 1%, 100 mW, 0603 [1608 Metric], Thick Film, General Purpose; Features: Moisture Resistant; Case Code (Imperial): 0603; Case/Package: 0603; Case Code (Metric): 1608
R604 = CMP-009-00203-1: Res Thick Film 1.6 x 0.8 mm 100K Ohm 1% 0.1W(1/10W) 100ppm/ C Molded SMD Paper T/R
R605 = CMP-009-00207-3: RES SMD 22.1KOHM 0.1% 1/10W 0603
R606 = CMP-009-00239-1: SMD Chip Resistor, 4.32 kOhm, ± 1%, 100 mW, 0603 [1608 Metric], Thick Film, Precision; Voltage Rating (DC): 50V; Voltage Rating: 75V; Temperature Coefficient: 100ppm/°C; Power Rating: 100mW; Reach SVHC Compliant: No; Case/Package: 0603; Radiation Hardening: No; Height: 0.45mm; Series: ERJ; Depth: 0.8mm; Contact Plating: Tin; Case Code (Imperial): 0603; Construction: Rectangular; Min Operating Temperature: -55°C; Technology: THICK FILM; Tolerance: 1%; Max Operating Temperature: 155°C; Mounting Technology: Surface Mount; Length: 1.6mm; Lead Free: Lead Free; RoHS Compliant: Yes; Case Code (Metric): 1608; Package Quantity: 1; Max Power Dissipation: 100mW; Termination: SMD/SMT; Packaging: Tape and Reel; Features: Automotive AEC-Q200; Resistance Tolerance: 1%; Resistor Type: Thick Film; Military Standard: Not; Number of Terminations: 2; Width: 0.8mm
U600 = CMP-019-00072-2: 3.5-V to 60-V, 5-A synchronous step-down voltage converter 30-WQFN -40 to 125; Max Supply Voltage: 60V; Max Output Voltage: 57V; Min Input Voltage: 3.5V; Max Operating Temperature: 125°C
U601 U603 = CMP-019-00083-1: IC REG LINEAR 5V 150MA SOT23-5 / 150-mA, 30-V, UltraLow IQ, Low-Dropout Regulators with Enable; Accuracy: 2%; Number of Outputs: 1; Quiescent Current: 1uA; Output Type: Fixed; Max Supply Voltage: 30V; Polarity: Positive; Min Input Voltage: 2.7V; Power Supply Rejection Ratio (PSRR): 80dB; Min Current Limit: 200mA; Dropout Voltage: 690mV; Width: 1.75mm; Length: 3.05mm; Pins: 5; Output Current: 150mA; Output Voltage: 5V; Series: -; Case/Package: SOT-23-5; Height: 1.3mm; Number of Regulators: 1; Mounting Technology: Surface Mount; Min Operating Temperature: -40°C; Max Operating Temperature: 125°C; Packaging: Tape and Reel; RoHS Compliant: Yes; Reach SVHC Compliant: No; Lead Free: Lead Free; Nominal Output Voltage: 5V; Radiation Hardening: No; Max Output current: 150mA; Package Quantity: 250
U602 = CMP-019-00081-1: 4.5V to 28V Input, 2A Output, EMI Friendly Synchronous Step-Down Converter 6-SOT-23-THIN -40 to 125; Min Output Voltage: 596mV; Synchronous Rectifier: Yes; Number of Outputs: 1; Output Type: Adjustable; Switching Frequency: 500kHz; Output Configuration: Positive; Max Duty Cycle: 100%; Quiescent Current: 40uA; Nominal Supply Current: 45uA; Mounting Technology: Surface Mount; Series: Eco-Mode™; RoHS Compliant: Yes; Packaging: Tape and Reel; Case/Package: SOT-23-6; Min Input Voltage: 4.5V; Min Operating Temperature: -40°C; Max Supply Voltage: 28V; Max Operating Temperature: 125°C; Max Output Voltage: 28V; Output Current: 2A; Width: 1.6mm; Thickness: 870um; Height: 1.1mm; Min Supply Voltage: 4.5V; Length: 2.9mm; Number of Channels: 1; Lead Free: Lead Free; Pins: 6

## Nets that join several sheets
3V3: A (R202_A.1 R206_A.2), B (R202_B.1 R206_B.2), C (R202_C.1 R206_C.2), D (R202_D.1 R206_D.2), E (R202_E.1 R206_E.2), F (R202_F.1 R206_F.2), G (R202_G.1 R206_G.2), dcb_lite_logic (15 pins), dcdc_60v_12v (5 pins)
5V: X (C400_X.1 C401_X.1 U400_X.8), Y (C400_Y.1 C401_Y.1 U400_Y.1 U400_Y.8), dcdc_60v_12v (C603.1 U601.5)
5VCAN: dcb_lite_logic (C307.1 U302.3), dcdc_60v_12v (C613.1 U603.5)
12V: E (C200_E.2 U200_E.8 U200_E.9 U200_E.10), F (C200_F.2 U200_F.8 U200_F.9 U200_F.10), G (C200_G.2 U200_G.8 U200_G.9 U200_G.10), dcdc_60v_12v (6 pins)
GND: dcb_top (C100.2 R101.1), A (11 pins), B (11 pins), C (11 pins), D (11 pins), E (11 pins), F (11 pins), G (11 pins), dcb_lite_logic (54 pins), usb_input (9 pins), X (C400_X.2 C401_X.2 U400_X.1 U400_X.3), Y (C400_Y.2 C401_Y.2 U400_Y.3), dcb_single_input (9 pins), dcdc_60v_12v (27 pins)
VBUS: usb_input (D500.5 J500.A4_B9 J500.B4_A9), dcdc_60v_12v (D600.A)
VIN: dcb_top (R100.2), A (C200_A.2 U200_A.8 U200_A.9 U200_A.10), B (C200_B.2 U200_B.8 U200_B.9 U200_B.10), C (C200_C.2 U200_C.8 U200_C.9 U200_C.10), D (C200_D.2 U200_D.8 U200_D.9 U200_D.10), dcb_single_input (8 pins), dcdc_60v_12v (6 pins)
CANH: dcb_lite_logic (J300.3 U302.7), dcb_single_input (J702.3)
CANL: dcb_lite_logic (R308.2 U302.6), dcb_single_input (J702.8)
NetC202_A_1: A (C202_A.1 R205_A.2), X (U400_X.4)
NetC202_B_1: B (C202_B.1 R205_B.2), X (U400_X.5)
NetC202_C_1: C (C202_C.1 R205_C.2), X (U400_X.6)
NetC202_D_1: D (C202_D.1 R205_D.2), X (U400_X.7)
NetC202_E_1: E (C202_E.1 R205_E.2), Y (U400_Y.4)
NetC202_F_1: F (C202_F.1 R205_F.2), Y (U400_Y.5)
NetC202_G_1: G (C202_G.1 R205_G.2), Y (U400_Y.6)
NetQ200_A_1: A (Q200_A.1 R200_A.1 R201_A.1), dcb_lite_logic (U301.4)
NetQ200_B_1: B (Q200_B.1 R200_B.1 R201_B.1), dcb_lite_logic (U301.5)
NetQ200_C_1: C (Q200_C.1 R200_C.1 R201_C.1), dcb_lite_logic (U301.6)
NetQ200_D_1: D (Q200_D.1 R200_D.1 R201_D.1), dcb_lite_logic (U301.7)
NetQ200_E_1: E (Q200_E.1 R200_E.1 R201_E.1), dcb_lite_logic (U301.9)
NetQ200_F_1: F (Q200_F.1 R200_F.1 R201_F.1), dcb_lite_logic (U301.10)
NetQ200_G_1: G (Q200_G.1 R200_G.1 R201_G.1), dcb_lite_logic (U301.11)
SCL: dcb_lite_logic (R301.1 U300.20 U301.14), X (U400_X.10), Y (U400_Y.10)
SDA: dcb_lite_logic (R302.1 U300.19 U301.15), X (U400_X.9), Y (U400_Y.9)
USBDN: dcb_lite_logic (U300.26), usb_input (D500.3 J500.A7 J500.B7)
USBDP: dcb_lite_logic (U300.27), usb_input (D500.1 J500.A6 J500.B6)
VTAP: dcb_top (C100.1 R100.1 R101.2), Y (U400_Y.7)